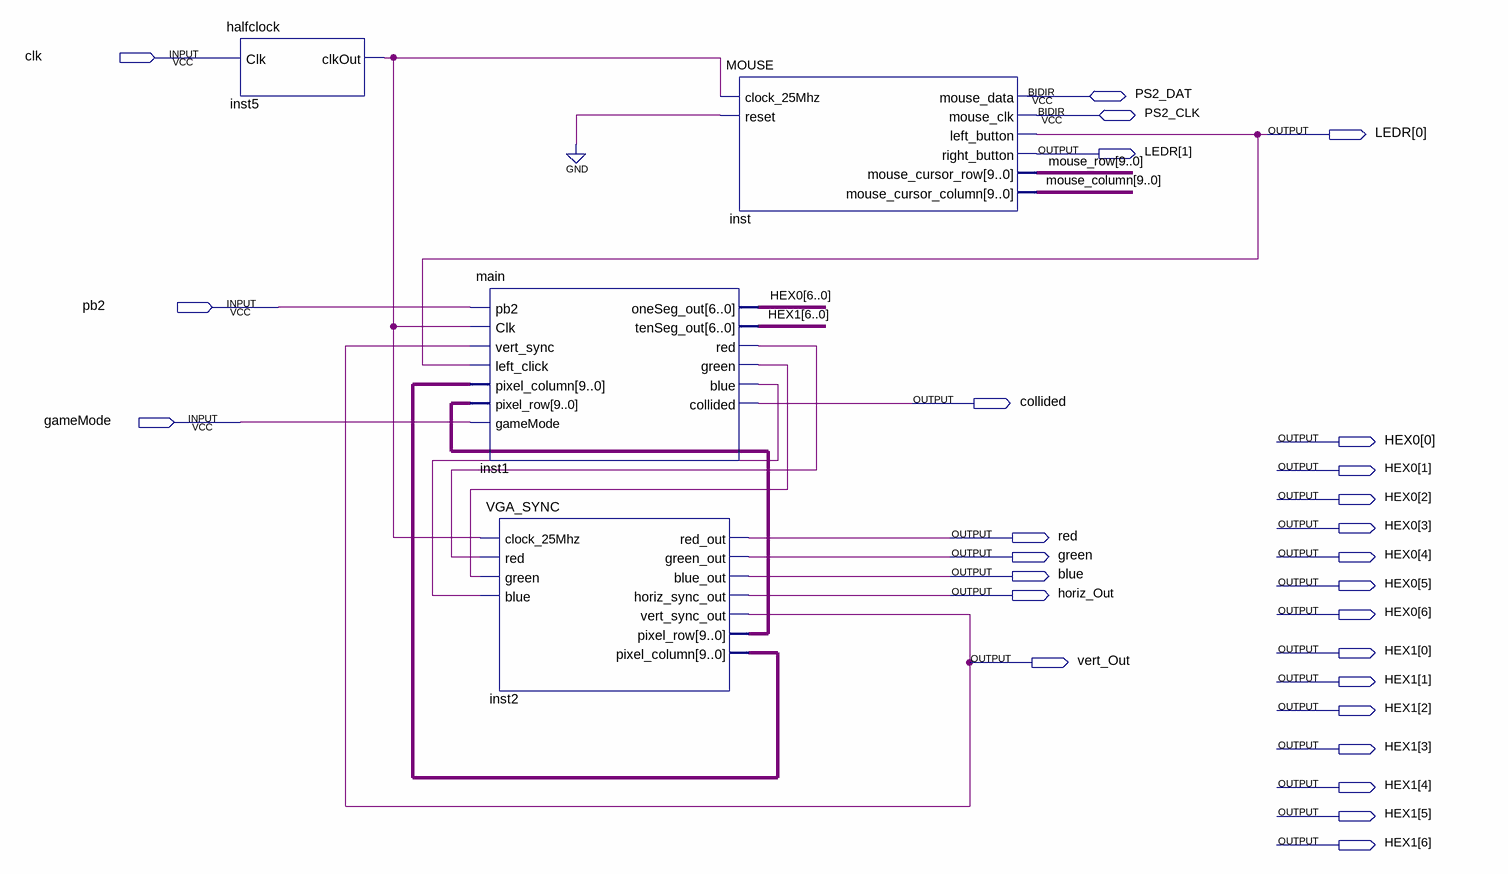
[diagram p0: schematic sheet]
// Quartus schematic MiniProjectQuartus.bdf as structural Verilog: 4 symbols, 27 pins
module MiniProjectQuartus (
  input  clk,
  input  pb2,
  input  gameMode,
  inout  PS2_DAT,
  inout  PS2_CLK,
  output [1:0] LEDR,
  output collided,
  output [6:0] HEX0,
  output red,
  output green,
  output blue,
  output horiz_Out,
  output [6:0] HEX1,
  output vert_Out
);

  wire inst1_blue, inst1_green, inst1_red, inst5_clkout;
  wire [9:0] inst2_pixel_column, inst2_pixel_row, mouse_column, mouse_row;

  halfclock inst5 (.Clk(clk), .clkOut(inst5_clkout));
  main inst1 (
    .pb2(pb2), .Clk(inst5_clkout), .vert_sync(vert_Out), .left_click(LEDR[0]),
    .pixel_column(inst2_pixel_column), .pixel_row(inst2_pixel_row), .gameMode(gameMode), .oneSeg_out(HEX0),
    .tenSeg_out(HEX1), .red(inst1_red), .green(inst1_green), .blue(inst1_blue), .collided(collided));
  VGA_SYNC inst2 (
    .clock_25Mhz(inst5_clkout), .red(inst1_red), .green(inst1_green), .blue(inst1_blue), .red_out(red),
    .green_out(green), .blue_out(blue), .horiz_sync_out(horiz_Out), .vert_sync_out(vert_Out),
    .pixel_row(inst2_pixel_row), .pixel_column(inst2_pixel_column));
  MOUSE inst (
    .clock_25Mhz(inst5_clkout), .reset(1'b0), .left_button(LEDR[0]), .right_button(LEDR[1]),
    .mouse_cursor_row(mouse_row), .mouse_cursor_column(mouse_column), .mouse_data(PS2_DAT),
    .mouse_clk(PS2_CLK));
endmodule
